# EAGLE schematic LedController (EAGLE 6.4)
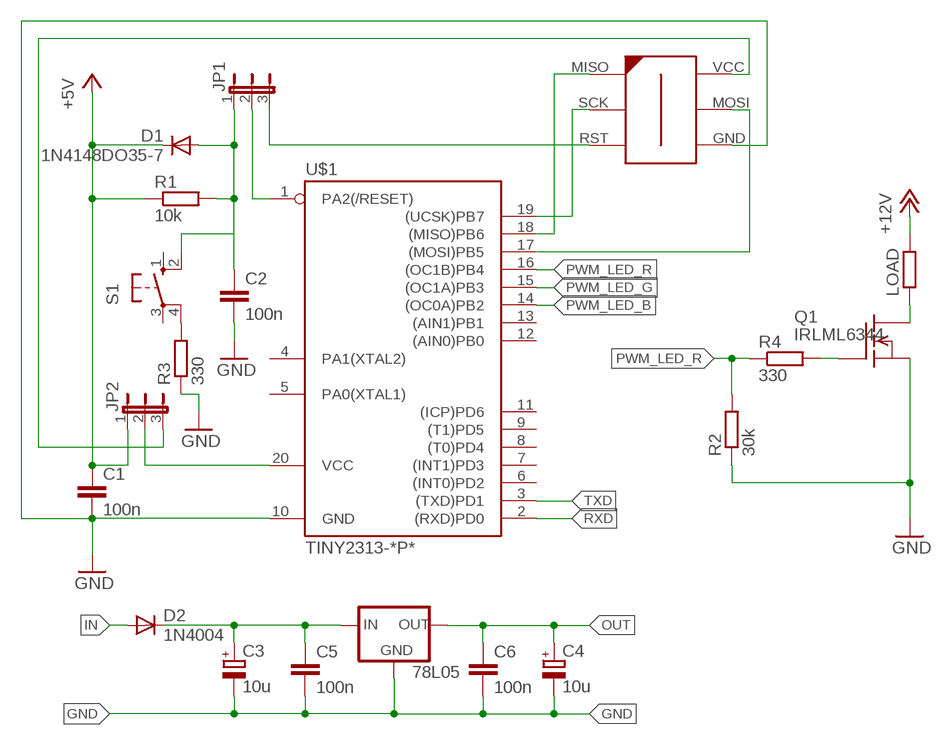
[diagram p0: schematic, sheet 1]

## Parts
78L05  78LXX  [78LXX]
C1  100n  C-EU025-024X044  [C025-024X044]
C2  100n  C-EU025-024X044  [C025-024X044]
C3  10u  CPOL-EUA  [PANASONIC_A]
C4  10u  CPOL-EUA  [PANASONIC_A]
C5  100n  C-EU075-032X103  [C075-032X103]
C6  100n  C-EU075-032X103  [C075-032X103]
D1  1N4148DO35-7  [DO35-7]
D2  1N4004  [DO41-10]
JP1  JP2E  [JP2]
JP2  JP2E  [JP2]
LOAD  R-EU_0204/2V  [0204V]
Q1  IRLML6344  BSS101  [TO92]
R1  10k  R-EU_0204/2V  [0204V]
R2  30k  R-EU_0204/2V  [0204V]
R3  330  R-EU_0204/2V  [0204V]
R4  330  R-EU_0204/2V  [0204V]
S1  10-XX  [B3F-10XX]
U$1  TINY2313-*P*  [DIL20]
U$2  AVR-ISP-6-EDGE  [6PAD_ISP]

## Nets
+5V: C1.1 D1.C JP2.1 R1.1
+12V: LOAD.2
GND: 78L05.GND C1.2 C2.2 C3.- C4.- C5.2 C6.2 Q1.1(S) R2.1 R3.1 U$1.10(GND) U$2.GND
IN: D2.A
N$1: C2.1 D1.A JP1.1 R1.2 S1.2(S1)
N$2: Q1.2(G) R4.2
N$3: U$1.17((MOSI)PB5) U$2.MOSI
N$4: LOAD.1 Q1.3(D)
N$5: U$1.18((MISO)PB6) U$2.MISO
N$6: 78L05.IN C3.+ C5.1 D2.C
N$7: U$1.19((UCSK)PB7) U$2.SCK
N$8: JP2.3 U$2.VCC
N$9: JP1.3 U$2.RST
N$10: JP1.2 U$1.1(PA2(/RESET))
N$11: JP2.2 U$1.20(VCC)
N$12: R3.2 S1.4(P1)
OUT: 78L05.OUT C4.+ C6.1
PWM_LED_B: U$1.14((OC0A)PB2)
PWM_LED_G: U$1.15((OC1A)PB3)
PWM_LED_R: R2.2 R4.1 U$1.16((OC1B)PB4)
RXD: U$1.2((RXD)PD0)
TXD: U$1.3((TXD)PD1)
Unconnected: S1.1(S) S1.3(P) U$1.4(PA1(XTAL2)) U$1.5(PA0(XTAL1)) U$1.6((INT0)PD2) U$1.7((INT1)PD3) U$1.8((T0)PD4) U$1.9((T1)PD5) U$1.11((ICP)PD6) U$1.12((AIN0)PB0) U$1.13((AIN1)PB1)

## Library data of the parts
78L05 = v-reg:78LXX: VOLTAGE REGULATOR
C1 C2 C5 C6 = rcl:C-EU: CAPACITOR, European symbol
C3 C4 = rcl:CPOL-EU: POLARIZED CAPACITOR, European symbol
D1 = diode:1N4148: DIODE high speed (Philips)
D2 = diode:1N4004: DIODE general purpose rectifier, 1 A
JP1 JP2 = jumper:JP2E: JUMPER
LOAD R1-R3 = rcl:R-EU_: RESISTOR, European symbol
Q1 = transistor-fet:BSS101: N-Channel Enhancement MOSFET 200V; 0,16A; 11Ohm
R4 = resistor:R-EU_: RESISTOR, European symbol
S1 = switch-omron:10-XX: OMRON SWITCH; MPN: B3F-1000; OC_FARNELL: 176432; OC_NEWARK: 36M3542
U$1 = avr-6:TINY2313*: Atmel Tiny2313 2K Flash, 128 bytes EEPROM, 128 bytes RAM
U$2 = avr-6:AVR-ISP-6-EDGE: 6 pin edge connector for ISP with ATMEL MCUs. Developed by Craig Moates (craig at moates dot net). Library by David Blundell (blundar at gmail dot com). Often, even a 6 pin header is really inconvenient for board layout and/or production. This SMD-only header is our de-facto standard for using an edge connector for programming with the help of a 6pin/10pin to edge card adapter.